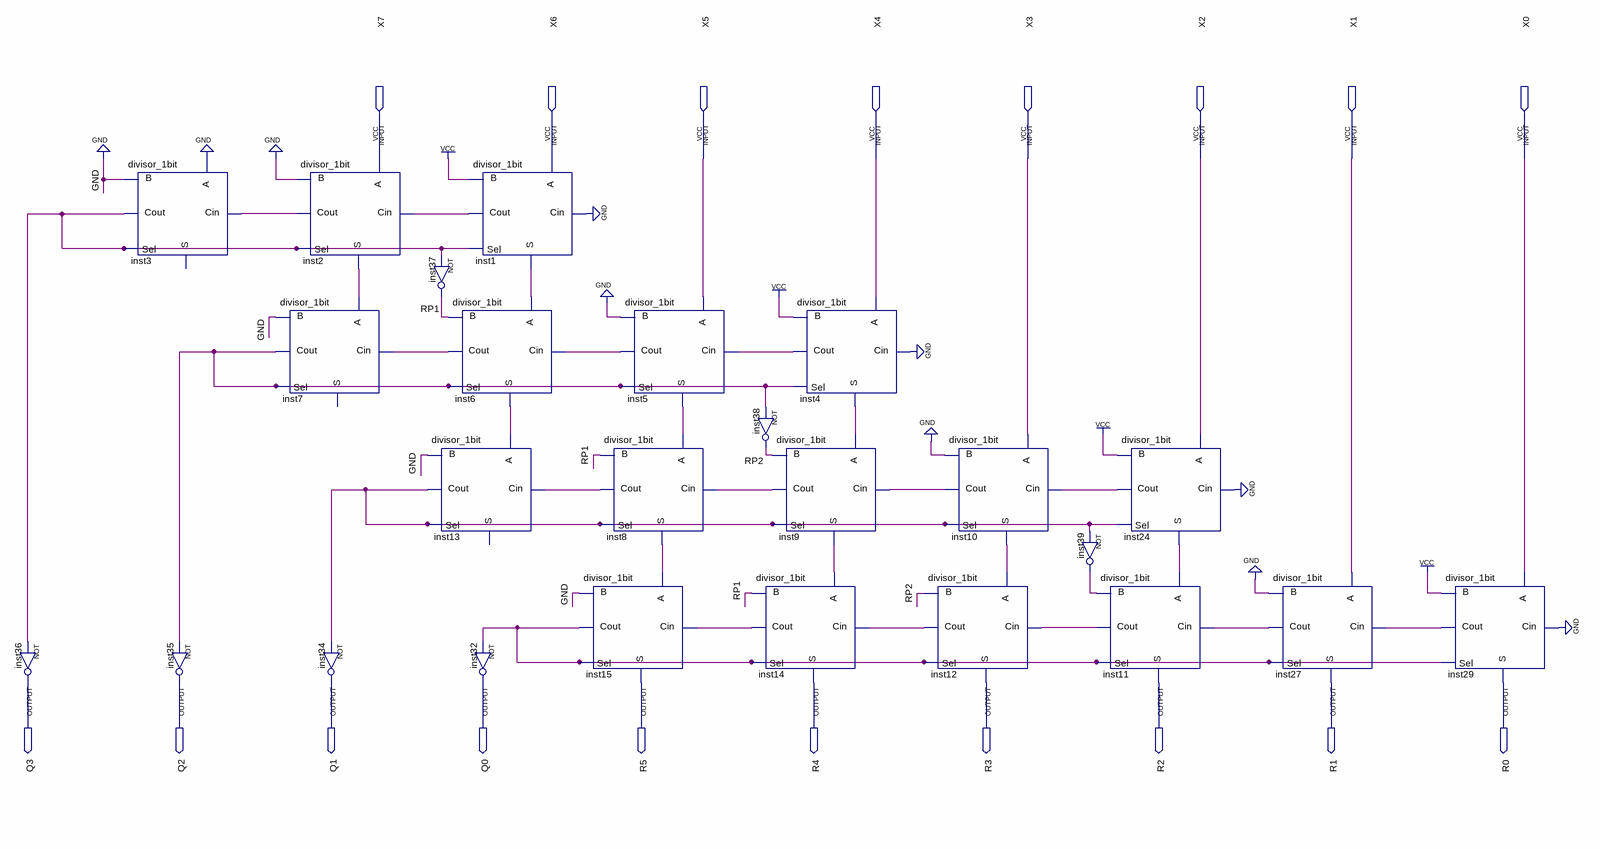
[diagram p0: schematic sheet]
// Quartus schematic raiz_8bit.bdf as structural Verilog: 25 symbols, 18 pins
module raiz_8bit (
  input  X7,
  input  X6,
  input  X5,
  input  X4,
  input  X3,
  input  X2,
  input  X1,
  input  X0,
  output Q3,
  output Q2,
  output Q1,
  output Q0,
  output R5,
  output R4,
  output R3,
  output R2,
  output R1,
  output R0
);

  wire inst1_cout, inst1_s, inst2_cout, inst2_s, inst3_cout, inst4_cout, inst4_s, inst5_cout, inst5_s,
       inst6_cout, inst6_s, inst7_cout, inst8_cout, inst8_s, inst9_cout, inst9_s, inst10_cout, inst10_s,
       inst11_cout, inst12_cout, inst13_cout, inst14_cout, inst15_cout, inst24_cout, inst24_s, inst27_cout,
       inst29_cout, inst39_out, RP1, RP2;

  not inst36 (Q3, inst3_cout);
  divisor_1bit inst3 (.A(1'b0), .B(1'b0), .Cin(inst2_cout), .Sel(inst3_cout), .Cout(inst3_cout));  // open: S
  not inst35 (Q2, inst7_cout);
  divisor_1bit inst7 (.A(inst2_s), .B(1'b0), .Cin(inst6_cout), .Sel(inst7_cout), .Cout(inst7_cout));  // open: S
  divisor_1bit inst2 (.A(X7), .B(1'b0), .Cin(inst1_cout), .Sel(inst3_cout), .S(inst2_s), .Cout(inst2_cout));
  not inst34 (Q1, inst13_cout);
  not inst37 (RP1, inst3_cout);
  divisor_1bit inst6 (.A(inst1_s), .B(RP1), .Cin(inst5_cout), .Sel(inst7_cout), .S(inst6_s), .Cout(inst6_cout));
  divisor_1bit inst13 (.A(inst6_s), .B(1'b0), .Cin(inst8_cout), .Sel(inst13_cout), .Cout(inst13_cout));  // open: S
  divisor_1bit inst1 (.A(X6), .B(1'b1), .Cin(1'b0), .Sel(inst3_cout), .S(inst1_s), .Cout(inst1_cout));
  not inst32 (Q0, inst15_cout);
  divisor_1bit inst8 (.A(inst5_s), .B(RP1), .Cin(inst9_cout), .Sel(inst13_cout), .S(inst8_s), .Cout(inst8_cout));
  divisor_1bit inst15 (.A(inst8_s), .B(1'b0), .Cin(inst14_cout), .Sel(inst15_cout), .S(R5), .Cout(inst15_cout));
  divisor_1bit inst5 (.A(X5), .B(1'b0), .Cin(inst4_cout), .Sel(inst7_cout), .S(inst5_s), .Cout(inst5_cout));
  not inst38 (RP2, inst7_cout);
  divisor_1bit inst9 (.A(inst4_s), .B(RP2), .Cin(inst10_cout), .Sel(inst13_cout), .S(inst9_s), .Cout(inst9_cout));
  divisor_1bit inst14 (.A(inst9_s), .B(RP1), .Cin(inst12_cout), .Sel(inst15_cout), .S(R4), .Cout(inst14_cout));
  divisor_1bit inst4 (.A(X4), .B(1'b1), .Cin(1'b0), .Sel(inst7_cout), .S(inst4_s), .Cout(inst4_cout));
  divisor_1bit inst10 (.A(X3), .B(1'b0), .Cin(inst24_cout), .Sel(inst13_cout), .S(inst10_s), .Cout(inst10_cout));
  divisor_1bit inst12 (.A(inst10_s), .B(RP2), .Cin(inst11_cout), .Sel(inst15_cout), .S(R3), .Cout(inst12_cout));
  not inst39 (inst39_out, inst13_cout);
  divisor_1bit inst11 (.A(inst24_s), .B(inst39_out), .Cin(inst27_cout), .Sel(inst15_cout), .S(R2), .Cout(inst11_cout));
  divisor_1bit inst24 (.A(X2), .B(1'b1), .Cin(1'b0), .Sel(inst13_cout), .S(inst24_s), .Cout(inst24_cout));
  divisor_1bit inst27 (.A(X1), .B(1'b0), .Cin(inst29_cout), .Sel(inst15_cout), .S(R1), .Cout(inst27_cout));
  divisor_1bit inst29 (.A(X0), .B(1'b1), .Cin(1'b0), .Sel(inst15_cout), .S(R0), .Cout(inst29_cout));
endmodule
